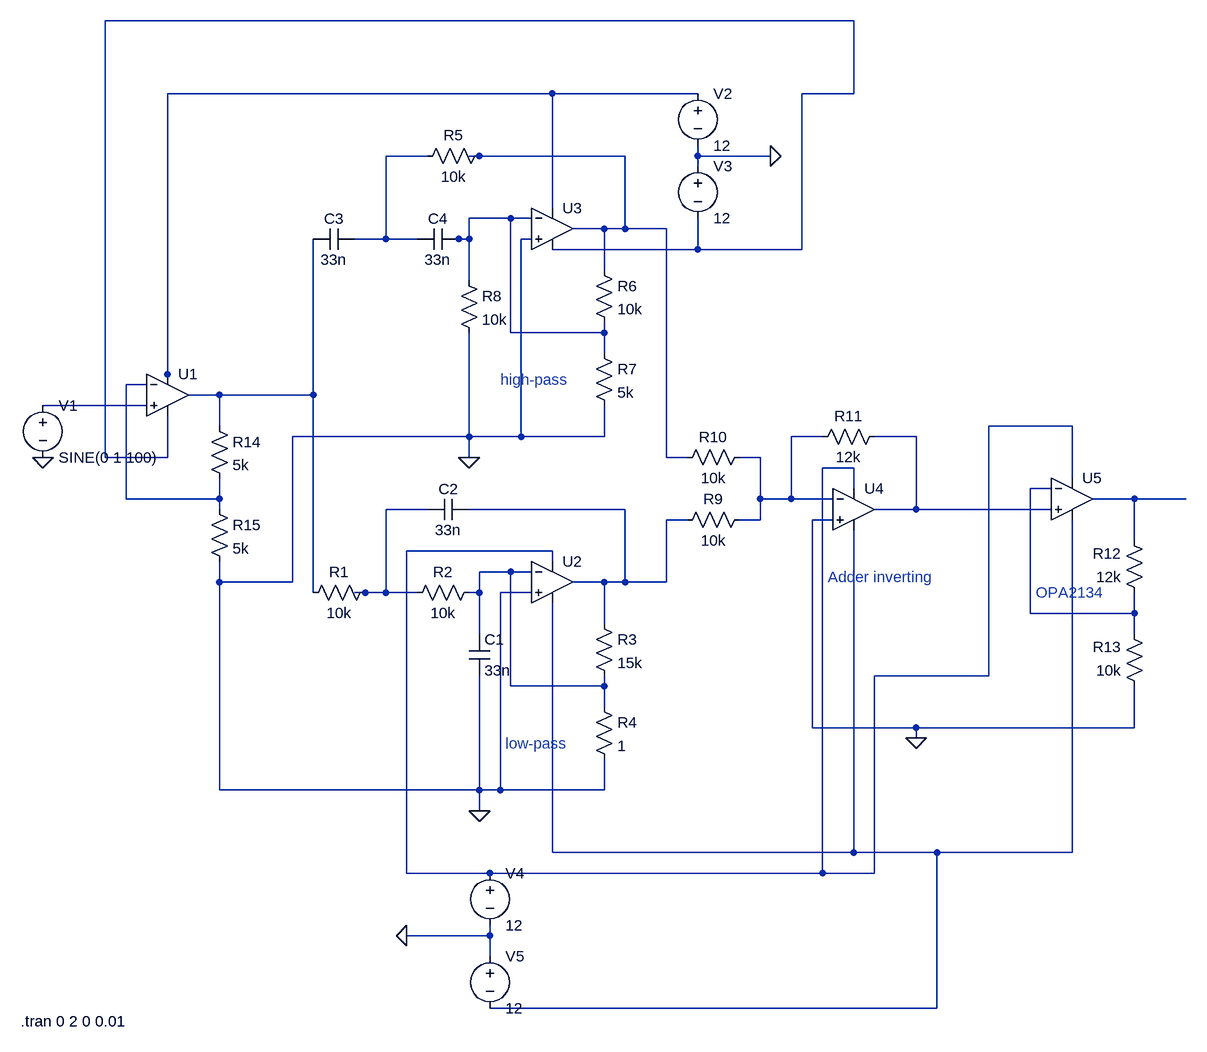
[diagram p0: schematic Lt 1Channel.asc]
Lt 1Channel.asc, the LTspice schematic file:
Version 4
SHEET 1 1268 964
WIRE 752 -592 -400 -592
WIRE 288 -480 -304 -480
WIRE 512 -480 288 -480
WIRE 752 -480 752 -592
WIRE 752 -480 672 -480
WIRE 96 -384 32 -384
WIRE 176 -384 160 -384
WIRE 400 -384 176 -384
WIRE 512 -384 512 -400
WIRE 624 -384 512 -384
WIRE 512 -368 512 -384
WIRE 288 -304 288 -480
WIRE 224 -288 160 -288
WIRE 256 -288 224 -288
WIRE 368 -272 320 -272
WIRE 400 -272 400 -384
WIRE 400 -272 368 -272
WIRE 464 -272 400 -272
WIRE 32 -256 32 -384
WIRE 32 -256 -16 -256
WIRE 80 -256 32 -256
WIRE 144 -256 128 -256
WIRE 160 -256 160 -288
WIRE 160 -256 144 -256
WIRE 256 -256 240 -256
WIRE 512 -240 512 -288
WIRE 512 -240 288 -240
WIRE 672 -240 672 -480
WIRE 672 -240 512 -240
WIRE 368 -208 368 -272
WIRE 160 -192 160 -256
WIRE 224 -112 224 -288
WIRE 368 -112 368 -128
WIRE 368 -112 224 -112
WIRE 368 -80 368 -112
WIRE -304 -48 -304 -480
WIRE -336 -32 -368 -32
WIRE -304 -32 -304 -48
WIRE -224 -16 -272 -16
WIRE -80 -16 -80 -256
WIRE -80 -16 -224 -16
WIRE -336 0 -496 0
WIRE -224 32 -224 -16
WIRE 1088 32 960 32
WIRE 160 48 160 -112
WIRE 160 48 -112 48
WIRE 240 48 240 -256
WIRE 240 48 160 48
WIRE 368 48 368 0
WIRE 368 48 240 48
WIRE 704 48 656 48
WIRE 848 48 784 48
WIRE -400 80 -400 -592
WIRE -304 80 -304 16
WIRE -304 80 -400 80
WIRE 160 80 160 48
WIRE 464 80 464 -272
WIRE 496 80 464 80
WIRE 608 80 576 80
WIRE 752 96 704 96
WIRE 1088 112 1088 32
WIRE 752 128 752 96
WIRE 1056 128 1024 128
WIRE -368 144 -368 -32
WIRE -224 144 -224 112
WIRE -224 144 -368 144
WIRE 608 144 608 80
WIRE 656 144 656 48
WIRE 656 144 608 144
WIRE 720 144 656 144
WIRE 1184 144 1120 144
WIRE 1264 144 1184 144
WIRE -224 160 -224 144
WIRE 96 160 32 160
WIRE 400 160 160 160
WIRE 848 160 848 48
WIRE 848 160 784 160
WIRE 1056 160 848 160
WIRE 496 176 464 176
WIRE 608 176 608 144
WIRE 608 176 576 176
WIRE 720 176 688 176
WIRE 1184 208 1184 144
WIRE 288 224 64 224
WIRE 288 240 288 224
WIRE 224 256 176 256
WIRE 256 256 224 256
WIRE -224 272 -224 240
WIRE -112 272 -112 48
WIRE -112 272 -224 272
WIRE 368 272 320 272
WIRE 400 272 400 160
WIRE 400 272 368 272
WIRE 464 272 464 176
WIRE 464 272 400 272
WIRE -80 288 -80 -16
WIRE 0 288 -16 288
WIRE 32 288 32 160
WIRE 32 288 0 288
WIRE 80 288 32 288
WIRE 176 288 176 256
WIRE 176 288 160 288
WIRE 256 288 208 288
WIRE 1024 320 1024 128
WIRE 1184 320 1184 288
WIRE 1184 320 1024 320
WIRE 368 336 368 272
WIRE 176 352 176 288
WIRE 1184 352 1184 320
WIRE 960 416 960 32
WIRE 960 416 784 416
WIRE 224 432 224 256
WIRE 368 432 368 416
WIRE 368 432 224 432
WIRE 368 464 368 432
WIRE 688 496 688 176
WIRE 848 496 688 496
WIRE 1184 496 1184 432
WIRE 1184 496 848 496
WIRE 848 512 848 496
WIRE -224 592 -224 272
WIRE 176 592 176 416
WIRE 176 592 -224 592
WIRE 208 592 208 288
WIRE 208 592 176 592
WIRE 368 592 368 544
WIRE 368 592 208 592
WIRE 176 624 176 592
WIRE 288 688 288 304
WIRE 752 688 752 192
WIRE 752 688 288 688
WIRE 880 688 752 688
WIRE 1088 688 1088 176
WIRE 1088 688 880 688
WIRE 64 720 64 224
WIRE 192 720 64 720
WIRE 704 720 704 96
WIRE 704 720 192 720
WIRE 784 720 784 416
WIRE 784 720 704 720
WIRE 192 816 192 800
WIRE 192 816 64 816
WIRE 192 848 192 816
WIRE 880 928 880 688
WIRE 880 928 192 928
FLAG 176 624 0
FLAG 160 80 0
FLAG 848 512 0
FLAG -496 80 0
FLAG 624 -384 0
FLAG 64 816 0
SYMBOL Opamps\\UniversalOpamp2 -304 -16 R0
SYMATTR InstName U1
SYMBOL Opamps\\UniversalOpamp2 288 272 R0
SYMATTR InstName U2
SYMBOL res 16 272 R90
WINDOW 0 0 56 VBottom 2
WINDOW 3 32 56 VTop 2
SYMATTR InstName R1
SYMATTR Value 10k
SYMBOL res 176 272 R90
WINDOW 0 0 56 VBottom 2
WINDOW 3 32 56 VTop 2
SYMATTR InstName R2
SYMATTR Value 10k
SYMBOL res 352 320 R0
SYMATTR InstName R3
SYMATTR Value 15k
SYMBOL res 352 448 R0
SYMATTR InstName R4
SYMATTR Value 1
SYMBOL cap 160 352 R0
SYMATTR InstName C1
SYMATTR Value 33n
SYMBOL cap 160 144 R90
WINDOW 0 0 32 VBottom 2
WINDOW 3 32 32 VTop 2
SYMATTR InstName C2
SYMATTR Value 33n
SYMBOL Opamps\\UniversalOpamp2 288 -272 R0
SYMATTR InstName U3
SYMBOL res 192 -400 R90
WINDOW 0 0 56 VBottom 2
WINDOW 3 32 56 VTop 2
SYMATTR InstName R5
SYMATTR Value 10k
SYMBOL res 352 -224 R0
SYMATTR InstName R6
SYMATTR Value 10k
SYMBOL res 352 -96 R0
SYMATTR InstName R7
SYMATTR Value 5k
SYMBOL cap -16 -272 R90
WINDOW 0 0 32 VBottom 2
WINDOW 3 32 32 VTop 2
SYMATTR InstName C3
SYMATTR Value 33n
SYMBOL cap 144 -272 R90
WINDOW 0 0 32 VBottom 2
WINDOW 3 32 32 VTop 2
SYMATTR InstName C4
SYMATTR Value 33n
SYMBOL res 144 -208 R0
SYMATTR InstName R8
SYMATTR Value 10k
SYMBOL Opamps\\UniversalOpamp2 752 160 R0
SYMATTR InstName U4
SYMBOL res 592 160 R90
WINDOW 0 0 56 VBottom 2
WINDOW 3 32 56 VTop 2
SYMATTR InstName R9
SYMATTR Value 10k
SYMBOL res 592 64 R90
WINDOW 0 0 56 VBottom 2
WINDOW 3 32 56 VTop 2
SYMATTR InstName R10
SYMATTR Value 10k
SYMBOL res 688 64 R270
WINDOW 0 32 56 VTop 2
WINDOW 3 0 56 VBottom 2
SYMATTR InstName R11
SYMATTR Value 12k
SYMBOL Opamps\\UniversalOpamp2 1088 144 R0
SYMATTR InstName U5
SYMBOL res 1200 304 R180
WINDOW 0 36 76 Left 2
WINDOW 3 36 40 Left 2
SYMATTR InstName R12
SYMATTR Value 12k
SYMBOL res 1200 448 R180
WINDOW 0 36 76 Left 2
WINDOW 3 36 40 Left 2
SYMATTR InstName R13
SYMATTR Value 10k
SYMBOL res -240 16 R0
SYMATTR InstName R14
SYMATTR Value 5k
SYMBOL res -240 144 R0
SYMATTR InstName R15
SYMATTR Value 5k
SYMBOL voltage -496 -16 R0
WINDOW 123 0 0 Left 2
WINDOW 39 0 0 Left 2
SYMATTR InstName V1
SYMATTR Value SINE(0 1 100)
SYMBOL voltage 512 -496 R0
WINDOW 123 0 0 Left 2
WINDOW 39 0 0 Left 2
SYMATTR InstName V2
SYMATTR Value 12
SYMBOL voltage 512 -384 R0
WINDOW 123 0 0 Left 2
WINDOW 39 0 0 Left 2
SYMATTR InstName V3
SYMATTR Value 12
SYMBOL voltage 192 704 R0
WINDOW 123 0 0 Left 2
WINDOW 39 0 0 Left 2
SYMATTR InstName V4
SYMATTR Value 12
SYMBOL voltage 192 832 R0
WINDOW 123 0 0 Left 2
WINDOW 39 0 0 Left 2
SYMATTR InstName V5
SYMATTR Value 12
TEXT 216 520 Left 2 ;low-pass
TEXT 208 -40 Left 2 ;high-pass
TEXT 1032 288 Left 2 ;OPA2134
TEXT 712 264 Left 2 ;Adder inverting
TEXT -530 948 Left 2 !.tran 0 2 0 0.01

The netlist it stands for:
* Lt 1Channel.asc
XU1 N008 N006 N002 N001 N007 level.2 Avol=1Meg GBW=10Meg Slew=10Meg ilimit=25m rail=0 Vos=0 phimargin=45 en=0 enk=0 in=0 ink=0 Rin=500Meg  ; pins IN+ IN- V+ V- OUT
XU2 0 N016 N009 N017 N015 level.2 Avol=1Meg GBW=10Meg Slew=10Meg ilimit=25m rail=0 Vos=0 phimargin=45 en=0 enk=0 in=0 ink=0 Rin=500Meg  ; pins IN+ IN- V+ V- OUT
R1 N014 N007 10k
R2 N016 N014 10k
R3 N015 N016 15k
R4 N016 0 1
C1 N016 0 33n
C2 N015 N014 33n
XU3 0 N005 N002 N001 N004 level.2 Avol=1Meg GBW=10Meg Slew=10Meg ilimit=25m rail=0 Vos=0 phimargin=45 en=0 enk=0 in=0 ink=0 Rin=500Meg  ; pins IN+ IN- V+ V- OUT
R5 N004 N003 10k
R6 N004 N005 10k
R7 N005 0 5k
C3 N003 N007 33n
C4 N005 N003 33n
R8 N005 0 10k
XU4 0 N010 N009 N017 N011 level.2 Avol=1Meg GBW=10Meg Slew=10Meg ilimit=25m rail=0 Vos=0 phimargin=45 en=0 enk=0 in=0 ink=0 Rin=500Meg  ; pins IN+ IN- V+ V- OUT
R9 N010 N015 10k
R10 N010 N004 10k
R11 N010 N011 12k
XU5 N011 N012 N009 N017 N013 level.2 Avol=1Meg GBW=10Meg Slew=10Meg ilimit=25m rail=0 Vos=0 phimargin=45 en=0 enk=0 in=0 ink=0 Rin=500Meg  ; pins IN+ IN- V+ V- OUT
R12 N012 N013 12k
R13 0 N012 10k
R14 N007 N006 5k
R15 N006 0 5k
V1 N008 0 SINE(0 1 100)
V2 N002 0 12
V3 0 N001 12
V4 N009 0 12
V5 0 N017 12
* low-pass
* high-pass
* OPA2134
* Adder inverting
.tran 0 2 0 0.01
.lib UniversalOpamps2.sub
.backanno
.end